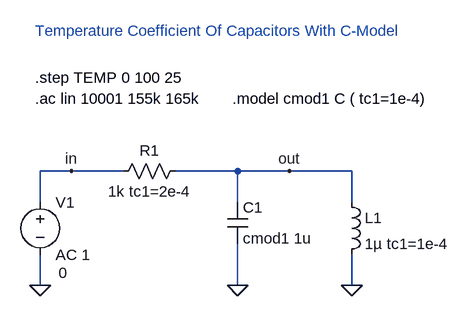
[diagram p0: schematic R_L_C_model_tempco.asc]
R_L_C_model_tempco.asc, the LTspice schematic file:
Version 4
SHEET 1 880 680
WIRE -208 224 -208 176
WIRE -208 352 -208 304
WIRE -160 176 -208 176
WIRE -80 176 -160 176
WIRE 96 176 0 176
WIRE 96 224 96 176
WIRE 96 352 96 288
WIRE 176 176 96 176
WIRE 272 176 176 176
WIRE 272 224 272 176
WIRE 272 352 272 304
FLAG 96 352 0
FLAG -208 352 0
FLAG 272 352 0
FLAG 176 176 out
FLAG -160 176 in
SYMBOL cap 80 224 R0
SYMATTR InstName C1
SYMATTR Value cmod1 1u
SYMBOL res -96 192 R270
WINDOW 0 32 56 VTop 0
WINDOW 3 0 56 VBottom 0
SYMATTR InstName R1
SYMATTR Value 1k tc1=2e-4
SYMBOL voltage -208 208 R0
WINDOW 3 28 125 Left 0
WINDOW 123 24 97 Left 0
WINDOW 39 0 0 Left 0
SYMATTR InstName V1
SYMATTR Value 0
SYMATTR Value2 AC 1
SYMBOL ind 256 208 R0
SYMATTR InstName L1
SYMATTR Value 1µ tc1=1e-4
TEXT 88 64 Left 0 !.model cmod1 C ( tc1=1e-4)
TEXT -216 64 Left 0 !.ac lin 10001 155k 165k
TEXT -216 32 Left 0 !.step TEMP 0 100 25
TEXT -216 -40 Left 0 ;Temperature Coefficient Of Capacitors With C-Model

The netlist it stands for:
* R_L_C_model_tempco.asc
C1 out 0 cmod1 1u
R1 in out 1k tc1=2e-4
V1 in 0 0 AC 1
L1 out 0 1µ tc1=1e-4
.model cmod1 C ( tc1=1e-4)
.ac lin 10001 155k 165k
.step TEMP 0 100 25
* Temperature Coefficient Of Capacitors With C-Model
.backanno
.end